# Altium schematic sheet Sheet1.SchDoc
size 381 x 241 mm; SheetNumber: 1; SheetTotal: 1
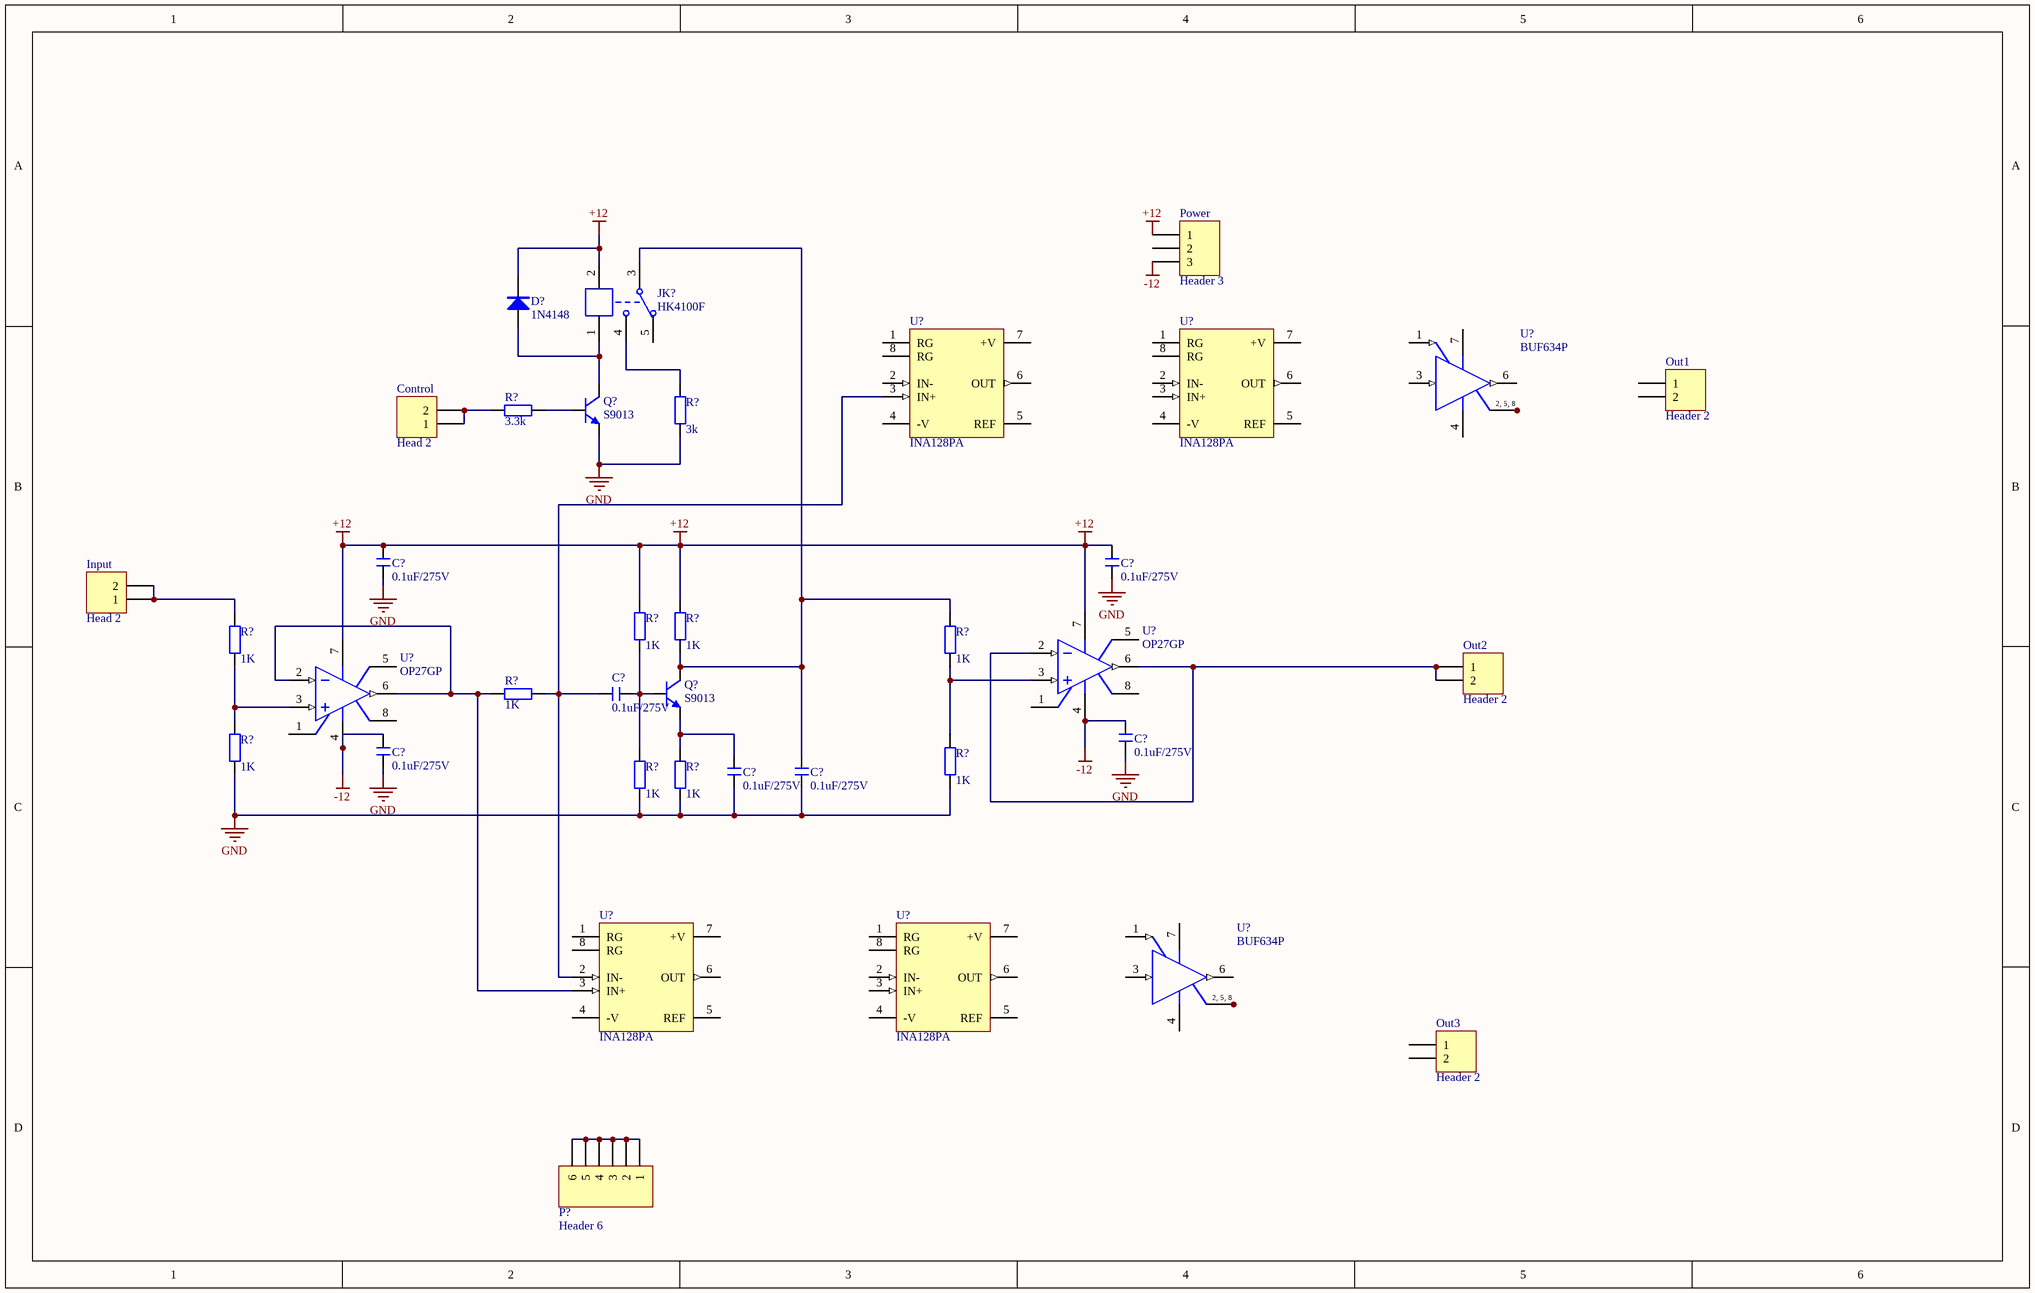
[diagram p0: Sheet1.SchDoc]

## Parts
(Parts that share a designator on the sheet are numbered #1, #2 ... from top to bottom, then left to right.)
C?#1  0.1uF/275V  [CBB-CL71]
C?#2  0.1uF/275V  [CBB-CL71]
C?#3  0.1uF/275V  [CBB-CL71]
C?#4  0.1uF/275V  [CBB-CL71]
C?#5  0.1uF/275V  [CBB-CL71]
C?#6  0.1uF/275V  [CBB-CL71]
C?#7  0.1uF/275V  [CBB-CL71]
Control  Head 2  [HDR1X2]
D?  1N4148  [MINI_MELF (LL34)]
Input  Head 2  [HDR1X2]
JK?  HK4100F  [DIP14]
Out1  Header 2  [HDR1X2]
Out2  Header 2  [HDR1X2]
Out3  Header 2  [HDR1X2]
P?  Header 6  [HDR1X6]
Power  Header 3  [HDR1X3]
Q?#1  S9013  [TO92]
Q?#2  S9013  [TO92]
R?#1  value 3.3k  [AXIAL-0.4]
R?#2  value 3k  [AXIAL-0.4]
R?#3  value 1K  [AXIAL-0.4]
R?#4  value 1K  [AXIAL-0.4]
R?#5  value 1K  [AXIAL-0.4]
R?#6  value 1K  [AXIAL-0.4]
R?#7  value 1K  [AXIAL-0.4]
R?#8  value 1K  [AXIAL-0.4]
R?#9  value 1K  [AXIAL-0.4]
R?#10  value 1K  [AXIAL-0.4]
R?#11  value 1K  [AXIAL-0.4]
U?#1  INA128PA  [006E]
U?#2  INA128PA  [006E]
U?#3  BUF634P  [006E]
U?#4  OP27GP  [N-8_A]
U?#5  OP27GP  [N-8_A]
U?#6  INA128PA  [006E]
U?#7  INA128PA  [006E]
U?#8  BUF634P  [006E]

## Nets
+12: C?#1.1 C?#2.1 D?.2(K) JK?.2 Power.1 R?#3.2 R?#4.2 U?#4.7(V+) U?#5.7(V+)
-12: C?#4.1 C?#5.1 Power.3 U?#4.4(V-) U?#5.4(V-)
GND: C?#1.2 C?#2.2 C?#4.2 C?#5.2 C?#6.1 C?#7.1 Q?#1.1(E) R?#2.1 R?#8.1 R?#9.1 R?#10.1 R?#11.1
NetC?#3_1: C?#3.1 R?#7.1 U?#1.3(IN+) U?#6.2(IN-)
NetC?#3_2: C?#3.2 Q?#2.2(B) R?#3.1 R?#10.2
NetC?#6_2: C?#6.2 Q?#2.1(E) R?#11.2
NetC?#7_2: C?#7.2 JK?.3 Q?#2.3(C) R?#4.1 R?#6.2
NetControl_1: Control.1 Control.2 R?#1.2
NetD?_1: D?.1(A) JK?.1 Q?#1.3(C)
NetInput_1: Input.1 Input.2 R?#5.2
NetJK?_4: JK?.4 R?#2.2
NetOut2_1: Out2.1 Out2.2 U?#4.2(IN-) U?#4.6(OUT)
NetP?_1: P?.1 P?.2 P?.3 P?.4 P?.5 P?.6
NetQ?#1_2: Q?#1.2(B) R?#1.1
NetR?#5_1: R?#5.1 R?#8.2 U?#5.3(IN+)
NetR?#6_1: R?#6.1 R?#9.2 U?#4.3(IN+)
NetR?#7_2: R?#7.2 U?#5.2(IN-) U?#5.6(OUT) U?#6.3(IN+)
NetU?#3_2: U?#3.2(NC) U?#3.5(NC) U?#3.8(NC)
NetU?#8_2: U?#8.2(NC) U?#8.5(NC) U?#8.8(NC)

Not connected (* = marked no-connect by the designer): JK? 5; Out1 1 2; Out3 1 2; Power 2; U?#1 1(RG) 2(IN-) 4(-V) 5(REF) 6(OUT) 7(+V) 8(RG); U?#2 1(RG) 2(IN-) 3(IN+) 4(-V) 5(REF) 6(OUT) 7(+V) 8(RG); U?#3 1(BW) 3(IN) 4(V-) 6(OUT) 7(V+); U?#4 1(CMPEN) 5(NC) 8(CMPEN); U?#5 1(CMPEN) 5(NC) 8(CMPEN); U?#6 1(RG) 4(-V) 5(REF) 6(OUT) 7(+V) 8(RG); U?#7 1(RG) 2(IN-) 3(IN+) 4(-V) 5(REF) 6(OUT) 7(+V) 8(RG); U?#8 1(BW) 3(IN) 4(V-) 6(OUT) 7(V+)

## Notes on the sheet
- (in symbol BUF634P) 2, 5, 8

## Library data of the parts
C?#1-C?#7 = C-CBB: CBB电容; 版权归属: 源创客; BOM名称: CBB电容; 学习资源: www.ooocke.com
Control Input Out1-Out3 = Header 2: Header, 2-Pin; LatestRevisionDate: 17-Jul-2002; LatestRevisionNote: Re-released for DXP Platform.; Publisher: Altium Limited
D? = 1N4148: 高速开关二极管; 版权归属: 源创客; BOM名称: 高速开关二极管; 学习资源: www.ooocke.com
JK? = HK4100F: 一组转换; BOM名称: 一组继电器; 版权归属: 源创客; 学习资源: www.ooocke.com
P? = Header 6: Header, 6-Pin; LatestRevisionDate: 17-Jul-2002; LatestRevisionNote: Re-released for DXP Platform.; Publisher: Altium Limited
Power = Header 3: Header, 3-Pin; LatestRevisionDate: 17-Jul-2002; LatestRevisionNote: Re-released for DXP Platform.; Publisher: Altium Limited
Q?#1 Q?#2 = 9013-DIP: 低频放大-NPN型; 版权归属: 源创客; 属性: 50V 0.5A 0.625W; BOM名称: 低频放大-NPN型; 学习资源: www.ooocke.com
R?#1-R?#11 = Res2: Resistor; Published: 8-Jun-2000; LatestRevisionDate: 17-Jul-2002; LatestRevisionNote: Re-released for DXP Platform.; PackageReference: AXIAL-0.4; Publisher: Altium Limited; PackageDescription: Axial Device, Thru-Hole; 2 Leads; 0.4 in Pin Spacing
U?#1 U?#2 U?#6 U?#7 = INA128PA: Precision, Low-Power Instrumentation Amplifiers; Published: 8-Jun-2000; LatestRevisionDate: 06-Jun-2005; LatestRevisionNote: Stylized 3D Model Added.; DatasheetVersion: Oct-1996; PackageVersion: revE; PackageReference: 006E; Publisher: Altium Limited; PackageDescription: DIP; 8 Leads; Row Spacing 7.62 mm; Pitch 2.54 mm; ComponentLink1Description: Manufacturer Link; ComponentLink1URL: http://www.ti.com/; ComponentLink2Description: Datasheet; ComponentLink2URL: http://www-s.ti.com/sc/ds/INA128.pdf
U?#3 U?#8 = BUF634P: 250mA High-Speed Buffer; Note: Pins 2, 5 and 8 are No internal Connection (NC) pins.; Published: 8-Jun-2000; LatestRevisionDate: 06-Jun-2005; LatestRevisionNote: Stylized 3D Model Added.; DatasheetVersion: Jun-1996; PackageVersion: revE; PackageReference: 006E; Publisher: Altium Limited; PackageDescription: DIP; 8 Leads; Row Spacing 7.62 mm; Pitch 2.54 mm; ComponentLink1Description: Manufacturer Link; ComponentLink1URL: http://www.ti.com/; ComponentLink2Description: Datasheet; ComponentLink2URL: http://www-s.ti.com/sc/ds/BUF634.pdf
U?#4 U?#5 = OP27GP: Low-Noise, Precision Operational Amplifier; Note: Pin 5 is not connected.; Published: 8-Jun-2000; LatestRevisionDate: 04-Mar-2005; LatestRevisionNote: Stylized 3D Model Added.; DatasheetVersion: 1992; PackageReference: N-8_A; Publisher: Altium Limited; PackageDescription: DIP; 8 Leads; Row Spacing 7.62 mm; Pitch 2.54 mm; Code_JEDEC: MO-001-AN; ComponentLink1Description: Manufacturer Link; ComponentLink1URL: http://www.analog.com/en/prod/0,,759_786_OP27%2C00.html; ComponentLink2Description: Datasheet; ComponentLink2URL: http://www.analog.com/UploadedFiles/Data_Sheets/314538596OP27_c.pdf